# Altium schematic sheet breakoutconn.SchDoc
size A4
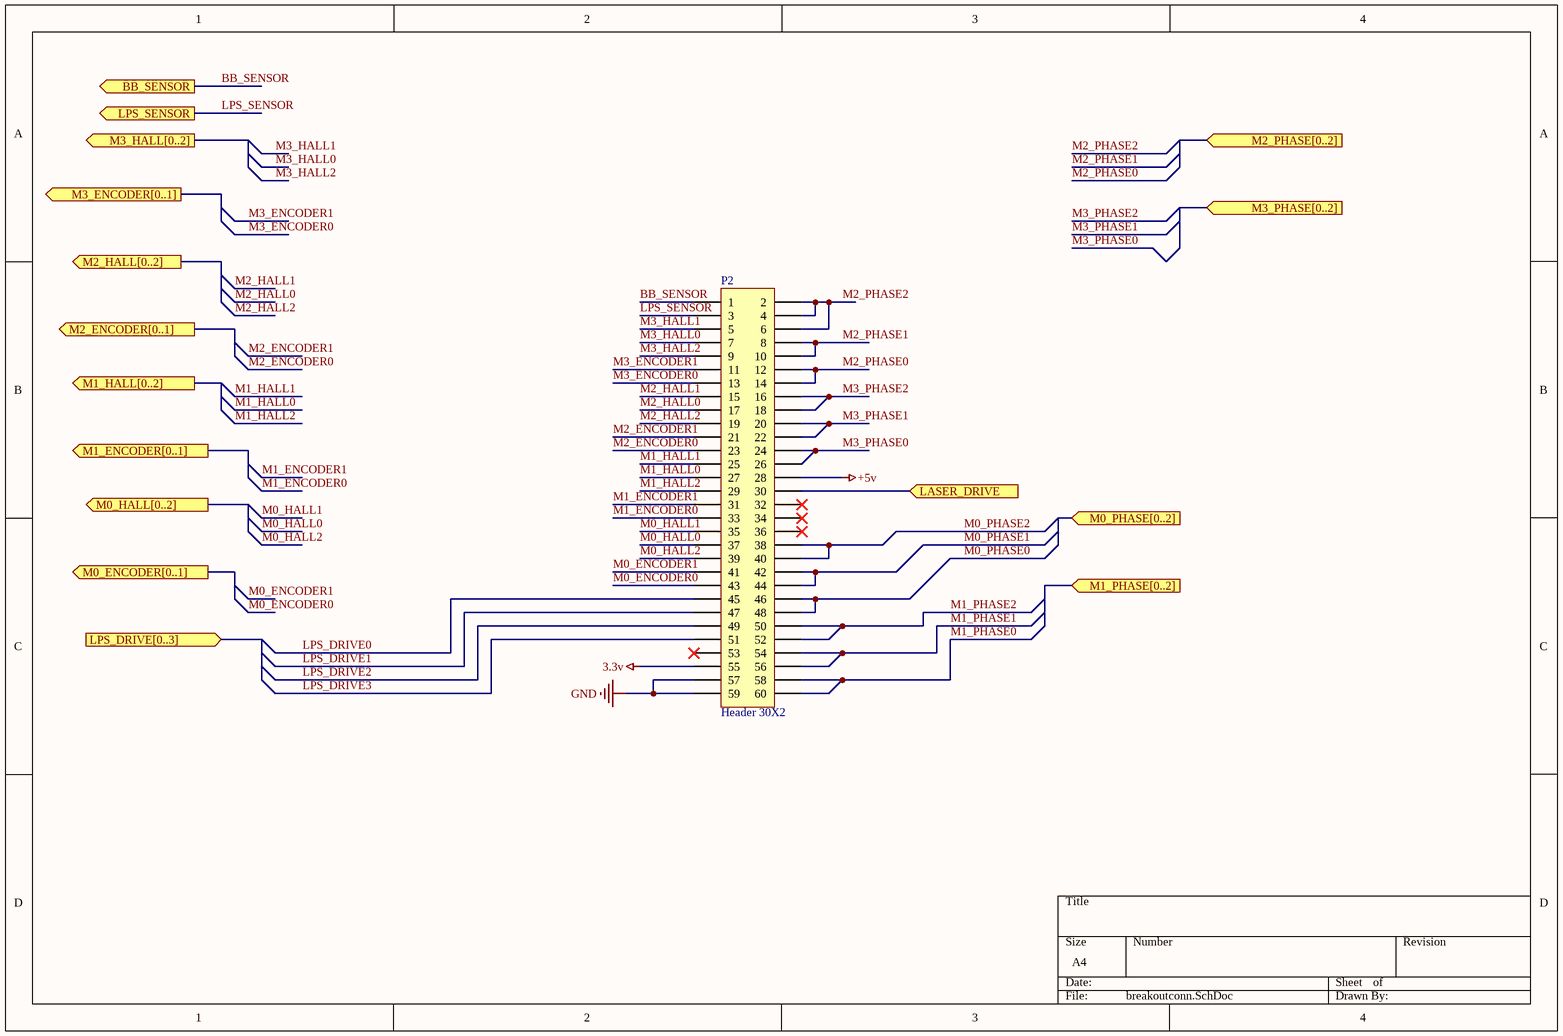
[diagram p0: breakoutconn.SchDoc]

## Parts
P2  Header 30X2  [HDR2X30]

## Ports
BB_SENSOR (out), LASER_DRIVE (in), LPS_DRIVE[0..3] (in), LPS_SENSOR (out), M0_ENCODER[0..1] (out), M0_HALL[0..2] (out), M0_PHASE[0..2] (in), M1_ENCODER[0..1] (out), M1_HALL[0..2] (out), M1_PHASE[0..2] (in), M2_ENCODER[0..1] (out), M2_HALL[0..2] (out), M2_PHASE[0..2] (in), M3_ENCODER[0..1] (out), M3_HALL[0..2] (out), M3_PHASE[0..2] (in)

## Nets
3.3v: P2.55
+5v: P2.28
GND: P2.57 P2.59
BB_SENSOR: P2.1 ; port BB_SENSOR
LASER_DRIVE: P2.30 ; port LASER_DRIVE
LPS_DRIVE0: P2.45
LPS_DRIVE1: P2.47
LPS_DRIVE2: P2.49
LPS_DRIVE3: P2.51
LPS_SENSOR: P2.3 ; port LPS_SENSOR
M0_ENCODER0: P2.43
M0_ENCODER1: P2.41
M0_HALL0: P2.37
M0_HALL1: P2.35
M0_HALL2: P2.39
M0_PHASE0: P2.46 P2.48
M0_PHASE1: P2.42 P2.44
M0_PHASE2: P2.38 P2.40
M1_ENCODER0: P2.33
M1_ENCODER1: P2.31
M1_HALL0: P2.27
M1_HALL1: P2.25
M1_HALL2: P2.29
M1_PHASE0: P2.58 P2.60
M1_PHASE1: P2.54 P2.56
M1_PHASE2: P2.50 P2.52
M2_ENCODER0: P2.23
M2_ENCODER1: P2.21
M2_HALL0: P2.17
M2_HALL1: P2.15
M2_HALL2: P2.19
M2_PHASE0: P2.12 P2.14
M2_PHASE1: P2.8 P2.10
M2_PHASE2: P2.2 P2.4 P2.6
M3_ENCODER0: P2.13
M3_ENCODER1: P2.11
M3_HALL0: P2.7
M3_HALL1: P2.5
M3_HALL2: P2.9
M3_PHASE0: P2.24 P2.26
M3_PHASE1: P2.20 P2.22
M3_PHASE2: P2.16 P2.18

Not connected (* = marked no-connect by the designer): P2 32* 34* 36* 53*

## Library data of the parts
P2 = Header 30X2: Header, 30-Pin, Dual row; LatestRevisionDate: 17-Jul-2002; LatestRevisionNote: Re-released for DXP Platform.; Publisher: Altium Limited